# EAGLE design esp_button_panel (EAGLE 8.0.1)
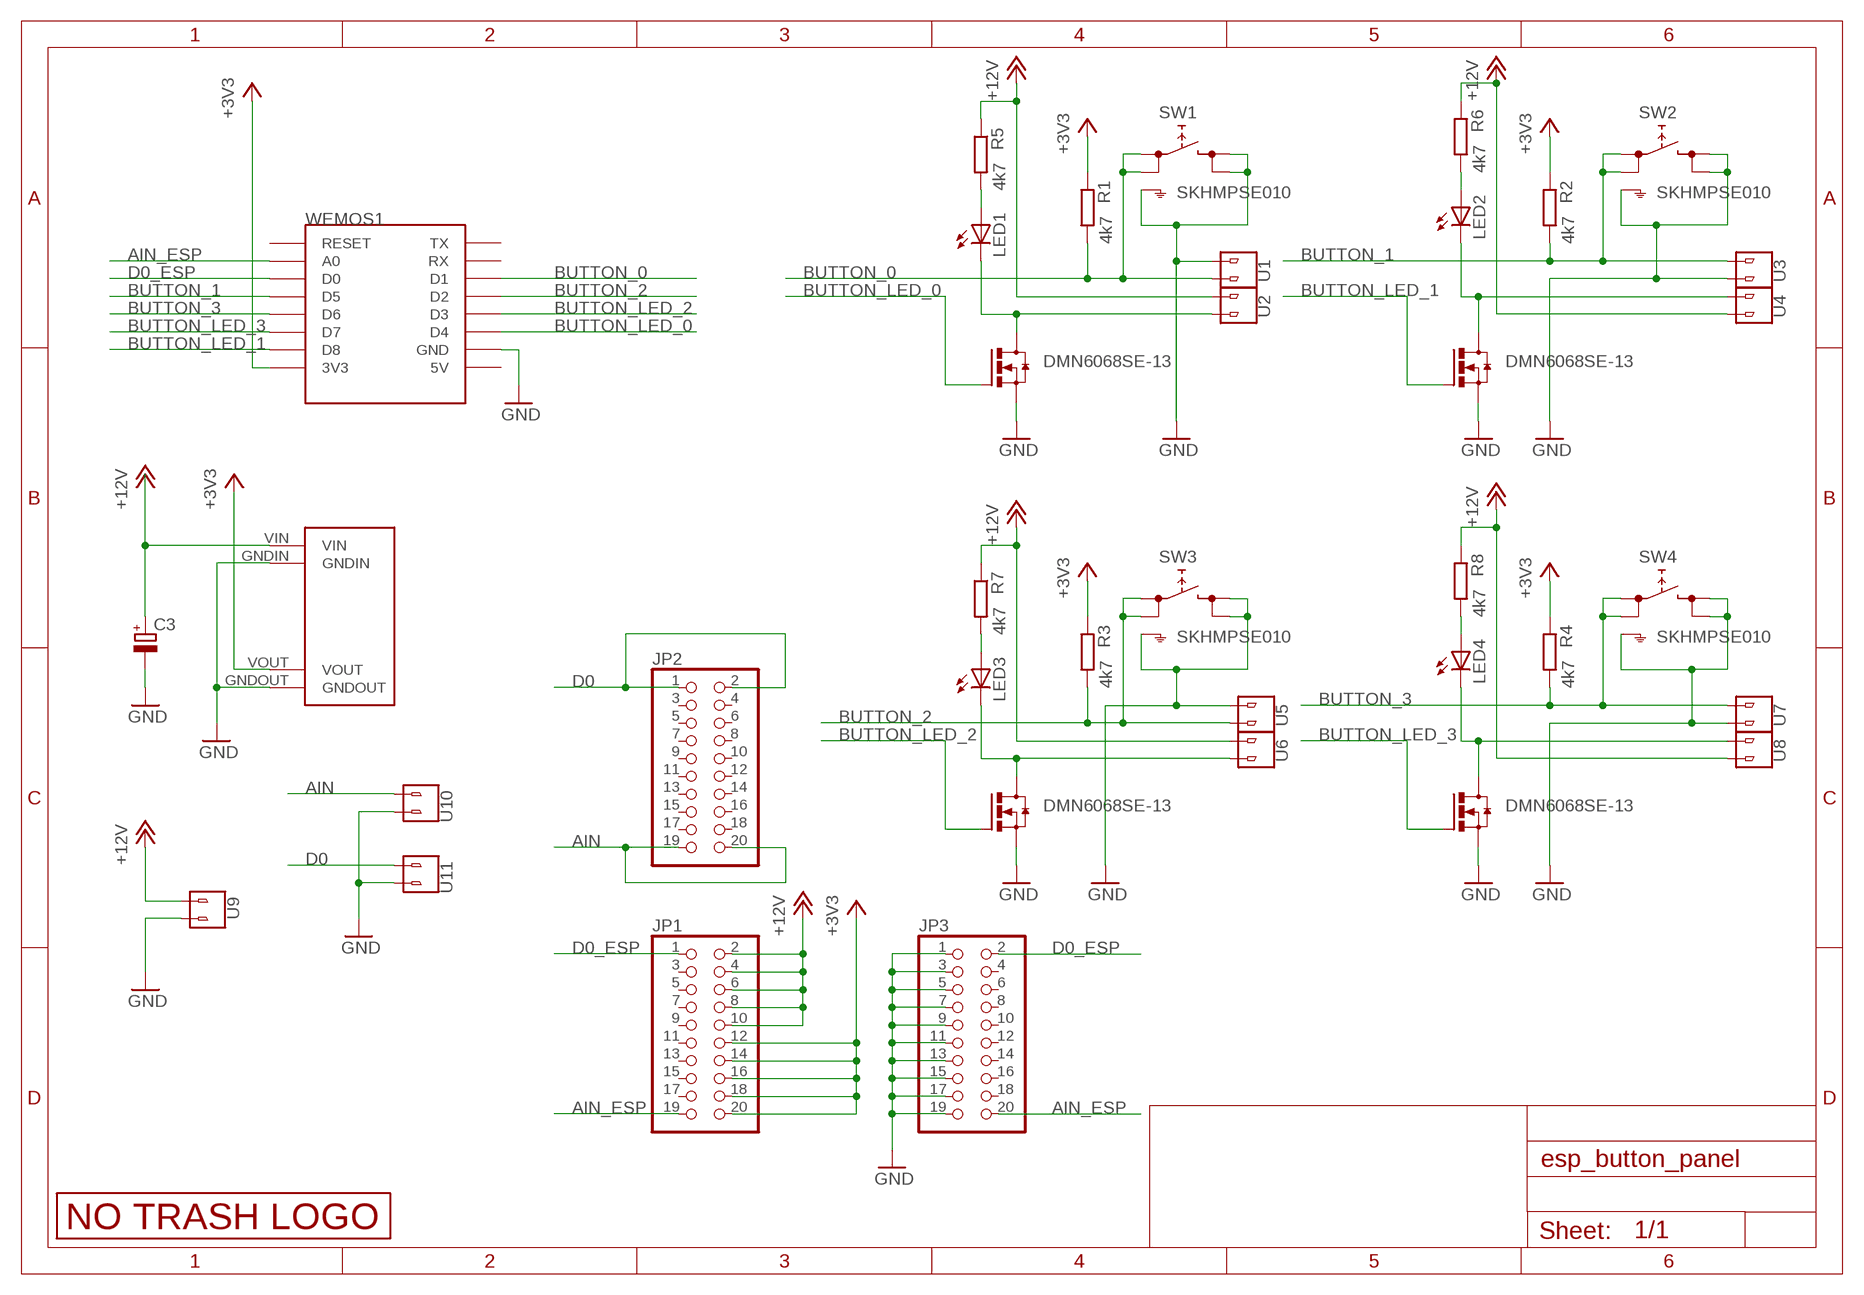
[diagram p0: schematic, sheet 1]

## Parts
C3  CPOL-EU150CLZ-0810  [150CLZ-0810]
JP1  PINHD-2X10  [2X10]
JP2  PINHD-2X10  [2X10]
JP3  PINHD-2X10  [2X10]
LED1  LEDCHIPLED_0805  [CHIPLED_0805]
LED2  LEDCHIPLED_0805  [CHIPLED_0805]
LED3  LEDCHIPLED_0805  [CHIPLED_0805]
LED4  LEDCHIPLED_0805  [CHIPLED_0805]
R1  4k7  R-EU_M0805  [M0805]
R2  4k7  R-EU_M0805  [M0805]
R3  4k7  R-EU_M0805  [M0805]
R4  4k7  R-EU_M0805  [M0805]
R5  4k7  R-EU_M0805  [M0805]
R6  4k7  R-EU_M0805  [M0805]
R7  4k7  R-EU_M0805  [M0805]
R8  4k7  R-EU_M0805  [M0805]
SW1  SKHMPSE010  [SKHMPXE010]
SW2  SKHMPSE010  [SKHMPXE010]
SW3  SKHMPSE010  [SKHMPXE010]
SW4  SKHMPSE010  [SKHMPXE010]
T1  DMN6068SE-13  NMOSFET_SMD_223  [SOT223]
T2  DMN6068SE-13  NMOSFET_SMD_223  [SOT223]
T3  DMN6068SE-13  NMOSFET_SMD_223  [SOT223]
T4  DMN6068SE-13  NMOSFET_SMD_223  [SOT223]
U1  V1  2_PIN_CONNECTOR  [2_SCREW_PIN]
U2  V1  2_PIN_CONNECTOR  [2_SCREW_PIN]
U3  V1  2_PIN_CONNECTOR  [2_SCREW_PIN]
U4  V1  2_PIN_CONNECTOR  [2_SCREW_PIN]
U5  V1  2_PIN_CONNECTOR  [2_SCREW_PIN]
U6  V1  2_PIN_CONNECTOR  [2_SCREW_PIN]
U7  V1  2_PIN_CONNECTOR  [2_SCREW_PIN]
U8  V1  2_PIN_CONNECTOR  [2_SCREW_PIN]
U9  V1  2_PIN_CONNECTOR  [2_SCREW_PIN]
U10  V1  2_PIN_CONNECTOR  [2_SCREW_PIN]
U11  V1  2_PIN_CONNECTOR  [2_SCREW_PIN]
U$1  LOGO_NO_TRASHNO_TRASH  [LOGO_ROHS_NO_TRASH]
U$3  MP1584EN  [MP1584EN]
WEMOS1  WEMOS-D1-MINI  [WEMOS-D1-MINI]

## Nets
+3V3: JP1.12 JP1.14 JP1.16 JP1.18 JP1.20 R1.1 R2.1 R3.1 R4.1 U$3.VOUT WEMOS1.3V3
+12V: C3.+ JP1.2 JP1.4 JP1.6 JP1.8 JP1.10 R5.1 R6.1 R7.1 R8.1 U2.P$1 U4.P$2 U6.P$1 U8.P$2 U9.P$2 U$3.VIN
AIN: JP2.19 JP2.20 U10.P$2
AIN_ESP: JP1.19 JP3.20 WEMOS1.A0
BUTTON_0: R1.2 SW1.1(1.1) SW1.2(1.2) U1.P$2 WEMOS1.D1
BUTTON_1: R2.2 SW2.1(1.1) SW2.2(1.2) U3.P$1 WEMOS1.D5
BUTTON_2: R3.2 SW3.1(1.1) SW3.2(1.2) U5.P$2 WEMOS1.D2
BUTTON_3: R4.2 SW4.1(1.1) SW4.2(1.2) U7.P$1 WEMOS1.D6
BUTTON_LED_0: T1.1(G) WEMOS1.D4
BUTTON_LED_1: T2.1(G) WEMOS1.D8
BUTTON_LED_2: T3.1(G) WEMOS1.D3
BUTTON_LED_3: T4.1(G) WEMOS1.D7
D0: JP2.1 JP2.2 U11.P$2
D0_ESP: JP1.1 JP3.2 WEMOS1.D0
GND: C3.- JP3.1 JP3.3 JP3.5 JP3.7 JP3.9 JP3.11 JP3.13 JP3.15 JP3.17 JP3.19 SW1.3(2.1) SW1.4(2.2) SW1.5(SH) SW2.3(2.1) SW2.4(2.2) SW2.5(SH) SW3.3(2.1) SW3.4(2.2) SW3.5(SH) SW4.3(2.1) SW4.4(2.2) SW4.5(SH) T1.3(S) T2.3(S) T3.3(S) T4.3(S) U1.P$1 U3.P$2 U5.P$1 U7.P$2 U9.P$1 U10.P$1 U11.P$1 U$3.GNDIN U$3.GNDOUT WEMOS1.GND
N$3: LED1.C T1.2(D) T1.4(D) U2.P$2
N$4: LED2.A R6.2
N$5: LED1.A R5.2
N$6: LED3.A R7.2
N$7: LED2.C T2.2(D) T2.4(D) U4.P$1
N$10: LED4.A R8.2
N$11: LED3.C T3.2(D) T3.4(D) U6.P$2
N$15: LED4.C T4.2(D) T4.4(D) U8.P$1
Unconnected: JP1.3 JP1.5 JP1.7 JP1.9 JP1.11 JP1.13 JP1.15 JP1.17 JP2.3 JP2.4 JP2.5 JP2.6 JP2.7 JP2.8 JP2.9 JP2.10 JP2.11 JP2.12 JP2.13 JP2.14 JP2.15 JP2.16 JP2.17 JP2.18 JP3.4 JP3.6 JP3.8 JP3.10 JP3.12 JP3.14 JP3.16 JP3.18 WEMOS1.5V WEMOS1.RESET WEMOS1.RX WEMOS1.TX

## Library data of the parts
C3 = rcl:CPOL-EU: POLARIZED CAPACITOR, European symbol
JP1-JP3 = mylib:PINHD-2X10: PIN HEADER
LED1-LED4 = led:LED: LED OSRAM: - CHIPLED LG R971, LG N971, LY N971, LG Q971, LY Q971, LO R971, LY R971 LH N974, LH R974 LS Q976, LO Q976, LY Q976 LO Q996 - Hyper CHIPLED LW Q18S LB Q993, LB Q99A, LB R99A - SideLED LS A670, LO A670, LY A670, LG A670, LP A670 LB A673, LV A673, LT A673, LW A673 LH A674 LY A675 LS A676, LA A676, LO A676, LY A676, LW A676 LS A679, LY A679, LG A679 - Hyper Micro SIDELED® LS Y876, LA Y876, LO Y876, LY Y876 LT Y87S - SmartLED LW L88C, LW L88S LB L89C, LB L89S, LG L890 LS L89K, LO L89K, LY L89K LS L896, LA L896, LO L896, LY L896 - TOPLED LS T670, LO T670, LY T670, LG T670, LP T670 LSG T670, LSP T670, LSY T670, LOP T670, LYG T670 LG T671, LOG T671, LSG T671 LB T673, LV T673, LT T673, LW T673 LH T674 LS T676, LA T676, LO T676, LY T676, LB T676, LH T676, LSB T676, LW T676 LB T67C, LV T67C, LT T67C, LS T67K, LO T67K, LY T67K, LW E67C LS E67B, LA E67B, LO E67B, LY E67B, LB E67C, LV E67C, LT E67C LW T67C LS T679, LY T679, LG T679 LS T770, LO T770, LY T770, LG T770, LP T770 LB T773, LV T773, LT T773, LW T773 LH T774 LS E675, LA E675, LY E675, LS T675 LS T776, LA T776, LO T776, LY T776, LB T776 LHGB T686 LT T68C, LB T68C - Hyper Mini TOPLED® LB M676 - Mini TOPLED Santana® LG M470 LS M47K, LO M47K, LY M47K Source: http://www.osram.convergy.de LUXEON: - LUMILED® LXK2-PW12-R00, LXK2-PW12-S00, LXK2-PW14-U00, LXK2-PW14-V00 LXK2-PM12-R00, LXK2-PM12-S00, LXK2-PM14-U00 LXK2-PE12-Q00, LXK2-PE12-R00, LXK2-PE12-S00, LXK2-PE14-T00, LXK2-PE14-U00 LXK2-PB12-K00, LXK2-PB12-L00, LXK2-PB12-M00, LXK2-PB14-N00, LXK2-PB14-P00, LXK2-PB14-Q00 LXK2-PR12-L00, LXK2-PR12-M00, LXK2-PR14-Q00, LXK2-PR14-R00 LXK2-PD12-Q00, LXK2-PD12-R00, LXK2-PD12-S00 LXK2-PH12-R00, LXK2-PH12-S00 LXK2-PL12-P00, LXK2-PL12-Q00, LXK2-PL12-R00 Source: www.luxeon.com KINGBRIGHT: KA-3528ASYC Source: www.kingbright.com
R1-R8 = rcl:R-EU_: RESISTOR, European symbol
SW1-SW4 = buttons:SKHMP*E010: 6.2 X 6.5mm TACT Switch (SMD) Source: http://www3.alps.co.jp/WebObjects/catalog.woa/PDF/E/Switch/Tact/SKHM/SKHM.PDF
T1-T4 = transistor-power:NMOSFET_SMD_223
U1-U11 = JKW_CHIP:2_PIN_CONNECTOR
U$1 = JKW_CHIP:LOGO_NO_TRASH
U$3 = JKW_CHIP:MP1584EN
WEMOS1 = esp8266modules:WEMOS-D1-MINI: WeMos.cc D1 mini ESP8266 module

## Board
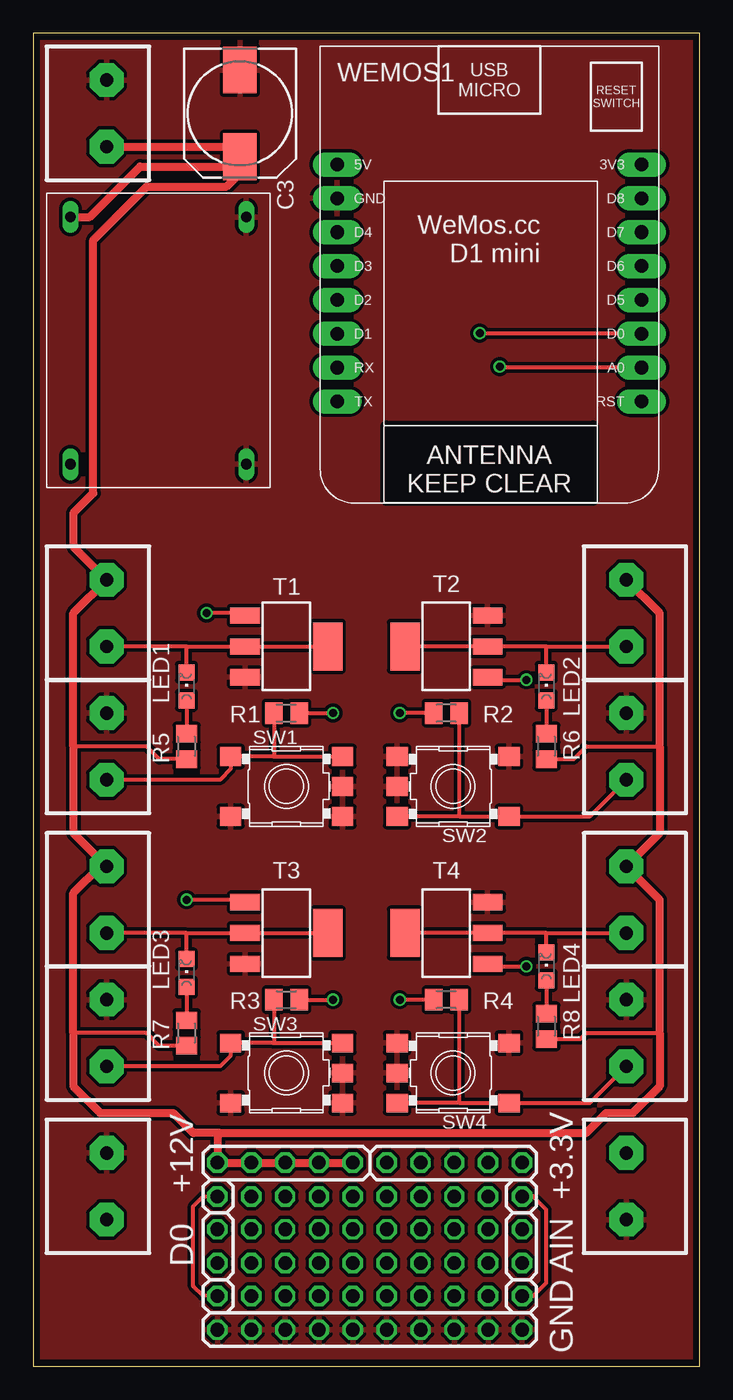
[diagram p1: board, top side]
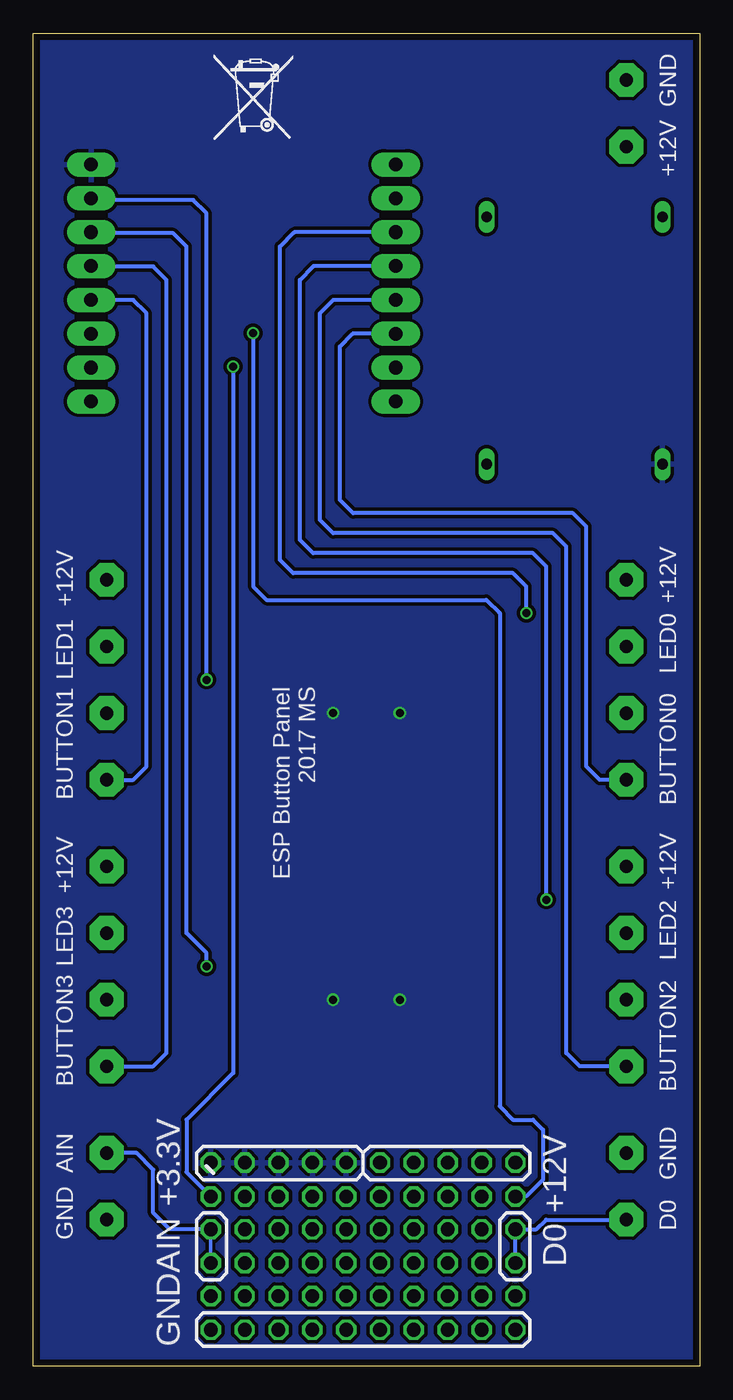
[diagram p2: board, bottom side, seen from below]

Size 50 x 100 mm. Coordinates in mm from the lower left corner, seen from the top.
Outline: 0,0 50,0 50,100 0,100 0,0
Copper layers (1*16): Top 0.035mm / dielectric 1.6mm / Bottom 0.035mm
Design rules "Elecrow_2-layer_PCB_eagle_rule": minimum track width 6mil, minimum drill 12mil, track to track 6mil, track to pad 6mil, pad to pad 6mil, via to via 8mil, smd to smd 0mil, copper to edge 20mil, drill to drill 10mil, minimum pad ring 6mil, minimum via ring 6mil, stop-mask expansion 0mil, vias tented up to drill 100mil, thermal gap 10mil
tRestrict: area 26.5,65 to 42,70.5

### Footprints (pad centres in the part's own frame; a part is rotated, then mirrored left to right if it is on the bottom)
150CLZ-0810 = smd 3.5 x 2.5: + 3.25,0; - -3.25,0
2X10 = drill 1.016 octagon: 1 -11.43,-1.27; 2 -11.43,1.27; 3 -8.89,-1.27; 4 -8.89,1.27; 5 -6.35,-1.27; 6 -6.35,1.27; 7 -3.81,-1.27; 8 -3.81,1.27; 9 -1.27,-1.27; 10 -1.27,1.27; 11 1.27,-1.27; 12 1.27,1.27; 13 3.81,-1.27; 14 3.81,1.27; 15 6.35,-1.27; 16 6.35,1.27; 17 8.89,-1.27; 18 8.89,1.27; 19 11.43,-1.27; 20 11.43,1.27
CHIPLED_0805 = smd 1.2 x 1.2: A 0,-1.05; C 0,1.05
M0805 = smd 1.3 x 1.6: 1 -0.95,0; 2 0.95,0
SKHMPXE010 = smd 1.6 x 1.4: 1 -4.2,2.25; 2 4.2,2.25; 3 -4.2,-2.25; 4 4.2,-2.25; 5 4.2,0
SOT223 = smd 1.219 x 2.235: 1 -2.311,-3.099; 2 0,-3.099; 3 2.311,-3.099 | smd 3.6 x 2.2: 4 0,3.099
2_SCREW_PIN = drill 1 pad 2.54 octagon: P$1 -2.5,0.5; P$2 2.5,0.5
MP1584EN = drill 0.8 long: GNDIN 1.778,14.986; GNDOUT 20.32,14.986; VIN 1.778,1.778; VOUT 20.32,1.778
WEMOS-D1-MINI = drill 1.016 pad 1.829 long: 3V3 -10.16,-10.16; 5V 12.7,-10.16; A0 -10.16,5.08; D0 -10.16,2.54; D1 12.7,2.54; D2 12.7,0; D3 12.7,-2.54; D4 12.7,-5.08; D5 -10.16,0; D6 -10.16,-2.54; D7 -10.16,-5.08; D8 -10.16,-7.62; GND 12.7,-7.62; RESET -10.16,7.62; RX 12.7,5.08; TX 12.7,7.62

### Placement (x,y rotation side)
C3  15.5,94 270 top
JP1  25.25,14 0 top
JP2  25.25,9 0 top
JP3  25.25,4 0 top
LED1  11.5,51 0 top
LED2  38.5,51 0 top
LED3  11.5,29.5 0 top
LED4  38.5,30 0 top
R1  19,49 180 top
R2  31,49 0 top
R3  19,27.5 180 top
R4  31,27.5 0 top
R5  11.5,46.5 90 top
R6  38.5,46.5 90 top
R7  11.5,25 90 top
R8  38.5,25.5 90 top
SW1  19,43.5 0 top
SW2  31.5,43.5 180 top
SW3  19,22 0 top
SW4  31.5,22 180 top
T1  19,54 270 top
T2  31,54 90 top
T3  19,32.5 270 top
T4  31,32.5 90 top
U1  5,46.5 270 top
U2  5,56.5 270 top
U3  45,46.5 90 top
U4  45,56.5 90 top
U5  5,25 270 top
U6  5,35 270 top
U7  45,25 90 top
U8  45,35 90 top
U9  5,94 270 top
U10  45,13.5 90 top
U11  5,13.5 270 top
U$1  36.5,92 0 bottom
U$3  1,88 270 top
WEMOS1  35.5,80 180 top

### Tracks (layer width: path | path; a pad name or v marks a point on that pad's centre or on a via)
+3V3  (via drill 0.6)
  Top 0.305: R1.1 v22.5,49 | R2.1 v27.5,49 | R4.1 v27.5,27.5 | R3.1 v22.5,27.5
  pour Bottom (isolate 0.254): 49.5,0.5 0.5,0.5 0.5,99.5 49.5,99.5
+12V
  Top 0.305: R5.1 9.45,45.55 8.5,46.5 3,46.5 | R7.1 9.45,24.05 8.5,25 3,25 | R6.1 40.55,45.55 41.5,46.5 47,46.5 | R8.1 41.05,24.55 41.5,25 47,25
  Top 0.61: U9.P$2 14.75,91.5 C3.+ | U$3.VIN 4.22,86.22 8,90 14.75,90 C3.+ | C3.+ 15.5,89.5 14.5,88.5 8.5,88.5 4.5,84.5 4.5,65.5 3,64 3,61.5 U2.P$1 3,56.5 3,46.5 3,40 U6.P$1 5,37.5 3,35.5 3,25 3,21 5,19 10.5,19 12,17.5 14,17.5 | 14,17.5 41.5,17.5 43,19 45,19 47,21 47,25 47,35 U8.P$2 47,40 47,46.5 47,56.5 U4.P$2 | 14,17.5 13.82,17.32 JP1.2 JP1.4 JP1.6 JP1.8 JP1.10
AIN
  Bottom 0.254: JP2.19 JP2.20
  Bottom 0.305: JP2.20 39.77,10.27 41,11.5 41,14.75 42.25,16 U10.P$2
AIN_ESP  (via drill 0.6)
  Top 0.305: WEMOS1.A0 35.08,74.92 v35,75 | JP3.20 37.52,5.27 38.5,6.25 38.5,11.75 37.5,12.75 36.7,12.75 JP1.19
  Bottom 0.305: v35,75 35,22 38.5,18.5 38.5,14.55 JP1.19
BUTTON_0
  Top 0.305: 18,45.75 SW1.2 | 18,45.75 SW1.1 14.8,44.8 14,44 U1.P$2 | R1.2 18.05,45.8 18,45.75
  Bottom 0.305: U1.P$2 7.5,44 8.5,45 8.5,63 9.5,64 26,64 27,65 27,76.5 26.04,77.46 WEMOS1.D1
BUTTON_1
  Top 0.305: 32,41.25 SW2.2 | 32,41.25 SW2.1 41.75,41.25 U3.P$1 | R2.2 31.95,41.3 32,41.25
  Bottom 0.305: U3.P$1 42.5,44 41.5,45 41.5,79 42.5,80 WEMOS1.D5
BUTTON_2
  Top 0.305: 18,24.25 SW3.2 | 18,24.25 SW3.1 14.8,23.3 14,22.5 U5.P$2 | R3.2 18.05,24.3 18,24.25
  Bottom 0.305: U5.P$2 9,22.5 10,23.5 10,61.5 11,62.5 27.5,62.5 28.5,63.5 28.5,79 27.5,80 WEMOS1.D2
BUTTON_3
  Top 0.305: 32,19.75 SW4.2 | 32,19.75 SW4.1 41.75,19.75 U7.P$1 | R4.2 31.95,19.8 32,19.75
  Bottom 0.305: U7.P$1 41,22.5 40,23.5 40,81.5 41,82.5 45.62,82.5 WEMOS1.D6
BUTTON_LED_0  (via drill 0.6)
  Top 0.305: T1.1 15.71,56.5 v13,56.5
  Bottom 0.305: WEMOS1.D4 30.42,85.08 31.5,84 31.5,60.5 30.5,59.5 14,59.5 13,58.5 v13,56.5
BUTTON_LED_1  (via drill 0.6)
  Top 0.305: T2.1 34.29,51.5 v37,51.5
  Bottom 0.305: WEMOS1.D8 45.54,87.5 38,87.5 37,86.5 v37,51.5
BUTTON_LED_2  (via drill 0.6)
  Top 0.305: T3.1 15.71,35 v11.5,35
  Bottom 0.305: WEMOS1.D3 28.96,82.54 30,81.5 30,62 29,61 12.5,61 11.5,60 v11.5,35
BUTTON_LED_3  (via drill 0.6)
  Top 0.305: T4.1 34.29,30 v37,30
  Bottom 0.305: WEMOS1.D7 45.58,85 39.5,85 38.5,84 38.5,32.5 37,31 v37,30
D0
  Bottom 0.305: U11.P$2 11.5,11 12.23,10.27 JP2.2 JP2.1
D0_ESP  (via drill 0.6)
  Top 0.305: JP3.2 12.73,5.27 12,6 12,12 12.75,12.75 13.8,12.75 JP1.1 | WEMOS1.D0 33.54,77.46 v33.5,77.5
  Bottom 0.305: JP1.1 13.8,12.75 13,12.75 11.75,14 11.75,17.75 12.5,18.5 14,18.5 15,19.5 15,56.5 16,57.5 32.5,57.5 33.5,58.5 v33.5,77.5
GND
  pour Top (isolate 0.254): 0.5,99.5 49.5,99.5 49.5,0.5 0.5,0.5
N$3
  Top 0.305: 11.5,54 U2.P$2 | 11.5,54 T1.2 T1.4 | LED1.C 11.5,54
N$4
  Top 0.305: LED2.A R6.2
N$5
  Top 0.305: LED1.A R5.2
N$6
  Top 0.305: LED3.A R7.2
N$7
  Top 0.305: 38.5,54 U4.P$1 | 38.5,54 T2.2 T2.4 | LED2.C 38.5,54
N$10
  Top 0.305: LED4.A R8.2
N$11
  Top 0.305: 11.5,32.5 U6.P$2 | 11.5,32.5 T3.2 T3.4 | LED3.C 11.5,32.5
N$15
  Top 0.305: 38.5,32.5 U8.P$1 | 38.5,32.5 T4.2 T4.4 | LED4.C 38.5,32.5

### Text on the board
tPlace: +12V | +3.3V | D0 | AIN | GND
bPlace: GND | +12V | +12V | +12V | LED0 | LED1 | ESP Button Panel / 2017 MS | BUTTON0 | BUTTON1 | +12V | +12V | LED2 | LED3 | BUTTON2 | BUTTON3 | GND | AIN | D0 | +12V | +3.3V | GND | D0 | AIN | GND